# EAGLE schematic nixie_thermometer (EAGLE 9.6.2)
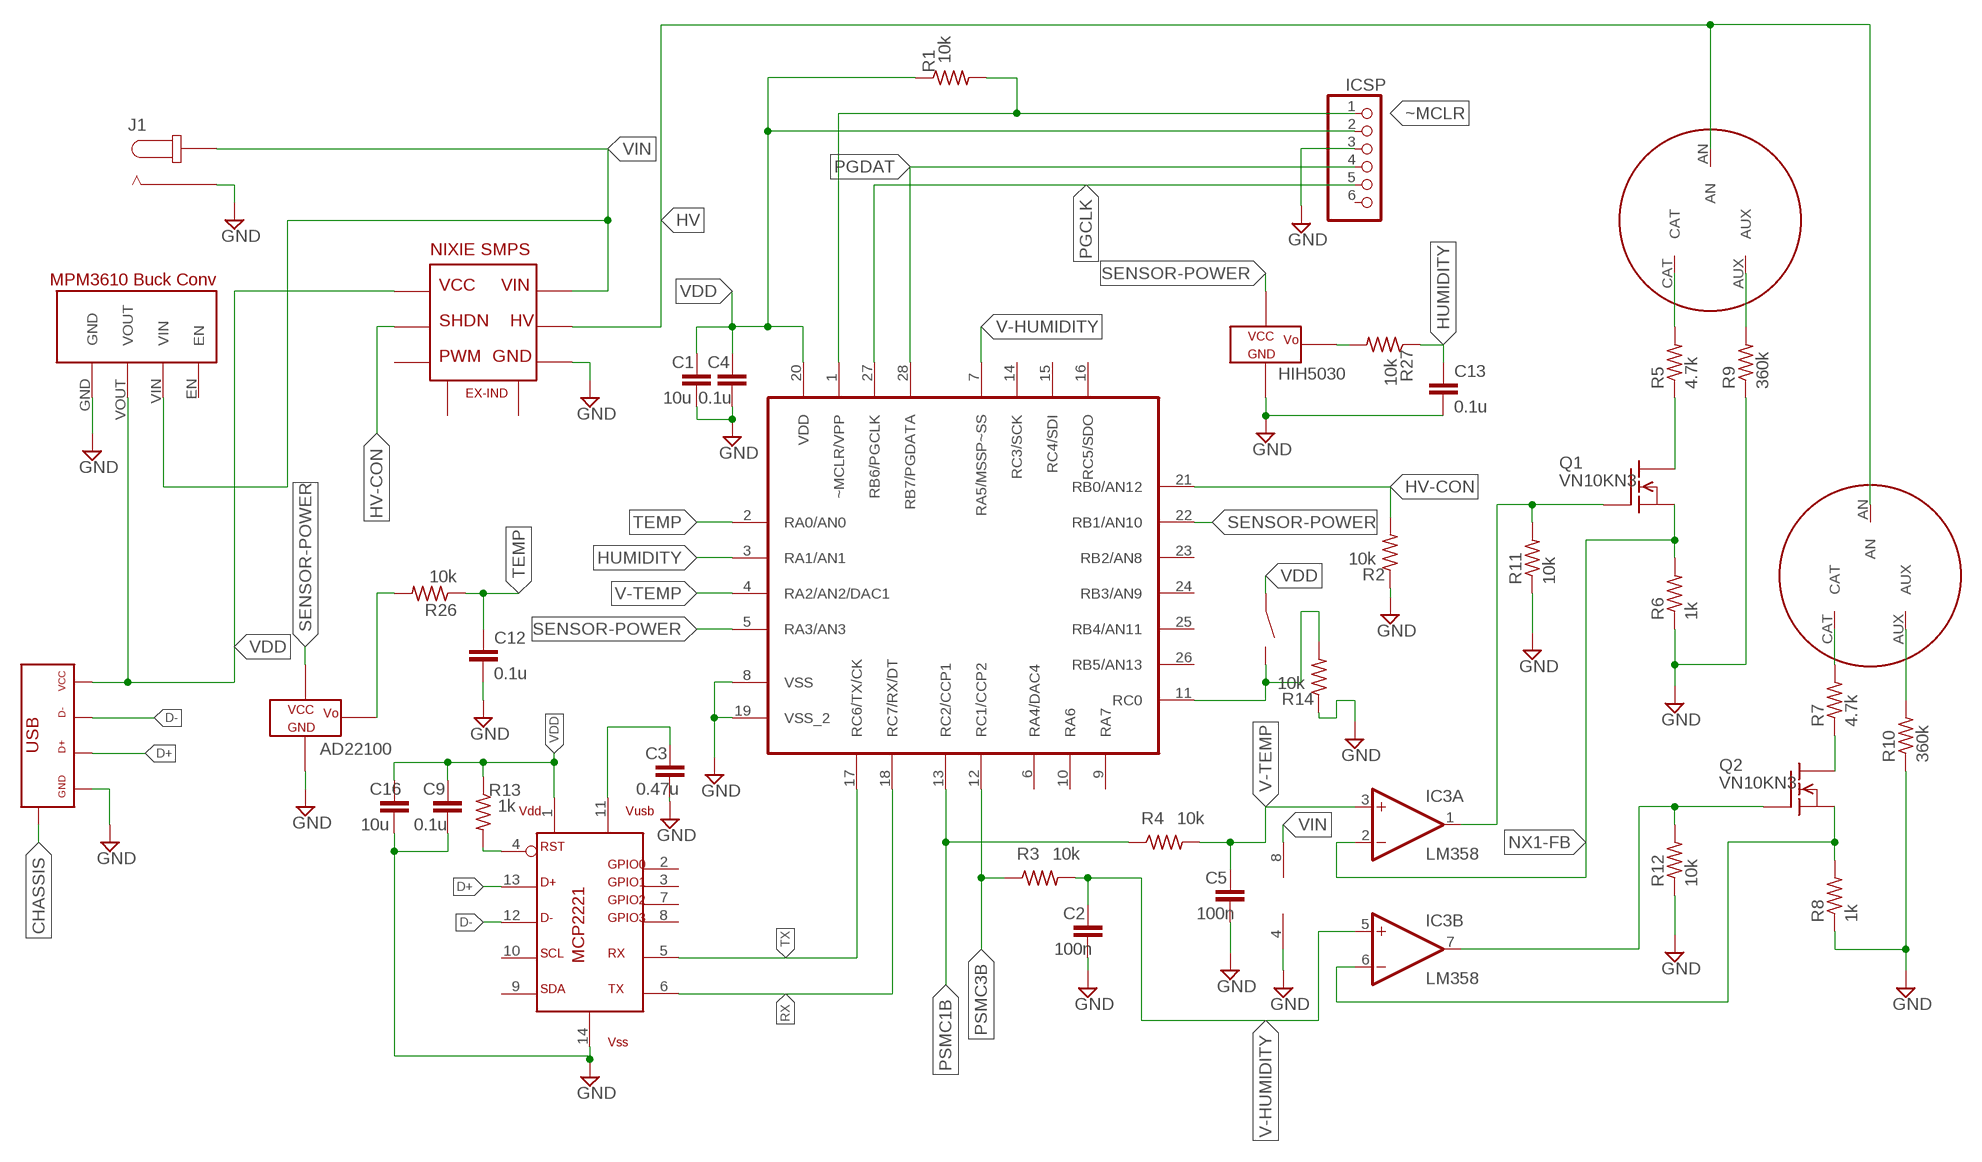
[diagram p0: schematic, sheet 1]

## Parts
AD22100  AD22100  [TO-92]
C1  10u  C-EUC0805  [C0805]
C2  100n  C-EUC0805  [C0805]
C3  0.47u  C-EUC0805  [C0805]
C4  0.1u  C-EUC0805  [C0805]
C5  100n  C-EUC0805  [C0805]
C9  0.1u  C-EUC0805  [C0805]
C12  0.1u  C1206  [C1206]
C13  0.1u  C1206  [C1206]
C16  10u  C-EUC0805  [C0805]
HIH5030  HIH5030  [HIH5030]
IC1  PIC16F1788  [DIP-28]
IC2  MCP2221  [SOIC-14]
IC3  LM358  [DIP-8]
ICSP  PINHD-1X6  [1X06]
J1  CONN-DC-JACK-PANEL  [DC-JACK]
Q1  VN10KN3  [TO-92]
Q2  VN10KN3  [TO-92]
R1  10k  R0805  [R0805]
R2  10k  R0805  [R0805]
R3  10k  R0805  [R0805]
R4  10k  R0805  [R0805]
R5  4.7k  R0204/7  [R0204/7]
R6  1k  R0204/7  [R0204/7]
R7  4.7k  R0204/7  [R0204/7]
R8  1k  R0204/7  [R0204/7]
R9  360k  R0204/7  [R0204/7]
R10  360k  R0204/7  [R0204/7]
R11  10k  R0204/7  [R0204/7]
R12  10k  R0204/7  [R0204/7]
R13  1k  R0805  [R0805]
R14  10k  R0805  [R0805]
R26  10k  R0805  [R0805]
R27  10k  R0805  [R0805]
U$1  MPM3610-ADAFRUIT  [MPM3610-ADAFRUIT-MODULE]
U$2  SMPS-HV-MODULE  [SMPS-HV-MOD-MODULE]
U$3  IN-13  [IN-13]
U$4  IN-13  [IN-13]
U$5  SW-SPST-PUSHBUTTONSMD  [SW-SPST-PUSHBUTTON-UNKNOWN-SMD]
USB$2  USB-MILLMAX-896-43-004  [USB-MILLMAX-896-43-004-90]

## Nets
CHASSIS: USB$2.P$5(SHIELD) USB$2.P$6(SHIELD)
D+: IC2.13(DP) USB$2.D+
D-: IC2.12(DM) USB$2.D-
GND: AD22100.3(GND) C1.2 C2.2 C3.2 C4.2 C5.2 C9.2 C12.2 C13.2 C16.2 HIH5030.GND IC1.8(VSS) IC1.19(VSS_2) IC2.14(VSS) IC3.4(P:V-) ICSP.3 J1.GND-BOT(GND) J1.GND-TOP(GND) R2.1 R6.1 R8.1 R9.1 R10.1 R11.1 R12.1 R14.1 U$1.GND U$2.GND U$2.GND-HV(GND) USB$2.GND
HUMID-RAW [ANALOG]: HIH5030.VO R27.2
HUMIDITY [ANALOG]: C13.1 IC1.3(RA1/AN1) R27.1
HV [HV]: U$2.HV U$3.AN U$4.AN
HV-CON: IC1.21(RB0/AN12) R2.2 U$2.SHDN
N$2: IC1.11(RC0) R14.2 U$5.P$6 U$5.P$8
N$6: Q1.3(D) R5.1
N$7: Q2.3(D) R7.1
N$10: C3.1 IC2.11(VUSB)
N$11: R9.2 U$3.AUX
N$12: R10.2 U$4.AUX
N$13: R5.2 U$3.CAT
N$15: R7.2 U$4.CAT
N$18: IC2.4(RST) R13.2
NX1-DRIVE [ANALOG]: IC3.1(A:OUT) Q1.2(G) R11.2
NX1-FB [ANALOG]: IC3.2(A:-IN) Q1.1(S) R6.2
NX2-DRIVE [ANALOG]: IC3.7(B:OUT) Q2.2(G) R12.2
NX2-FB [ANALOG]: IC3.6(B:-IN) Q2.1(S) R8.2
PGCLK: IC1.27(RB6/PGCLK) ICSP.5
PGDAT: IC1.28(RB7/PGDATA) ICSP.4
PSMC1B: IC1.13(RC2/CCP1) R4.1
PSMC3B: IC1.12(RC1/CCP2) R3.1
RX: IC1.18(RC7/RX/DT) IC2.6(TX)
SENSOR-POWER [PWR]: AD22100.1(VCC) HIH5030.VCC IC1.5(RA3/AN3) IC1.22(RB1/AN10)
TEMP [ANALOG]: C12.1 IC1.2(RA0/AN0) R26.1
TEMP-RAW [ANALOG]: AD22100.2(VO) R26.2
TX: IC1.17(RC6/TX/CK) IC2.5(RX)
V-HUMIDITY [ANALOG]: C2.1 IC1.7(RA5/MSSP~SS) IC3.5(B:+IN) R3.2
V-TEMP [ANALOG]: C5.1 IC1.4(RA2/AN2/DAC1) IC3.3(A:+IN) R4.2
VDD [PWR]: C1.1 C4.1 C9.1 C16.1 IC1.20(VDD) IC2.1(VDD) ICSP.2 R1.1 R13.1 U$1.VOUT U$2.VDD(VCC) U$5.P$5 U$5.P$7 USB$2.VCC
VIN [PWR]: IC3.8(P:V+) J1.POW-BOT(POW) J1.POW-TOP(POW) U$1.VIN U$2.VIN
~MCLR: IC1.1(~MCLR/VPP) ICSP.1 R1.2
Unconnected: IC1.6(RA4/DAC4) IC1.9(RA7) IC1.10(RA6) IC1.14(RC3/SCK) IC1.15(RC4/SDI) IC1.16(RC5/SDO) IC1.23(RB2/AN8) IC1.24(RB3/AN9) IC1.25(RB4/AN11) IC1.26(RB5/AN13) IC2.2(GPIO0) IC2.3(GPIO1) IC2.7(GPIO2) IC2.8(GPIO3) IC2.9(SDA) IC2.10(SCL) ICSP.6 U$1.EN U$2.EX-IND0 U$2.EX-INT1 U$2.OUTPUT

## Library data of the parts
AD22100 = IC:AD22100: Temperature sensor (2C accuracy, -50-150 C range) with single 5V power supply. Signal output can be filtered with a low-pass filter (1k, 0,1uF). The Vcc reference can be shared with MCU to eliminate the change in the power supply level.
C1-C5 C9 C16 = rcl:C-EU: CAPACITOR, European symbol; SPICEPREFIX: C
C12 C13 = RLC:C: Capacitor
HIH5030 = IC:HIH5030: Humidity sensor.
IC1 = IC:PIC16F1788: Microchip Microcontrollers, 8-bit; MPN: PIC16F876-04/SP; OC_FARNELL: 1523957; OC_NEWARK: 23C5083; PACKAGE: DIP-28; SUPPLIER: Microchip
IC2 = IC:MCP2221: USB to UART converter Operating voltage is 3.0 ~ 5.5 V.
IC3 = IC:LM358: OP AMP also LM158; LM258; LM2904
ICSP = pinhead:PINHD-1X6: PIN HEADER
J1 = Connector:CONN-DC-JACK-PANEL: DC POWER JACK Power Jack, DC, Right Angle, Through Hole, Rated 5A at 16VDC, PC Terminals Distributor: Farnell (www.Farnell.de) Drawing: 84N1161.pdf / 84N1162.pdf Manufacturer: SPC Technology (www.spctechnology.com) Type: SPC4077 / SPC 4078
Q1 Q2 = Transistor:VN10KN3: N-Channel 60 V 310mA (Tj) 1W (Tc) Through Hole TO-92-3
R1-R14 R26 R27 = RLC:R: Resistor
U$1 = IC:MPM3610-ADAFRUIT
U$2 = IC:SMPS-HV-MODULE
U$3 U$4 = Tubes:IN-13: Nixie tube IN-13, made by USSR, bargraph Firing voltage: 140 V Indicator maintaining voltage: 94-99 V Min working current: 0.2 - 0.6 mA Max working current: 3.5-4.6 mA Aux. current: 0.13 mA Recommended aux. ressitor: 330 - 360 kOhm.
U$5 = Connector:SW-SPST-PUSHBUTTON: Push button
USB$2 = Connector:USB-MILLMAX-896-43-004: USB-A (USB TYPE-A) USB 2.0 Receptacle Connector 4 Position Through Hole, Right Angle

## Net classes
1 HV: width 0.508 mm, clearance 1.016 mm to class 0
2 ANALOG: width 0.508 mm, clearance 0.508 mm to class 0, clearance 1.016 mm to class 1, clearance 0.508 mm
3 PWR: width 0.508 mm, clearance 1.016 mm to class 1, clearance 0.254 mm to class 2, clearance 0.254 mm